# Altium schematic sheet Light Detector.SchDoc
size A4; SheetNumber: 2; SheetTotal: 7
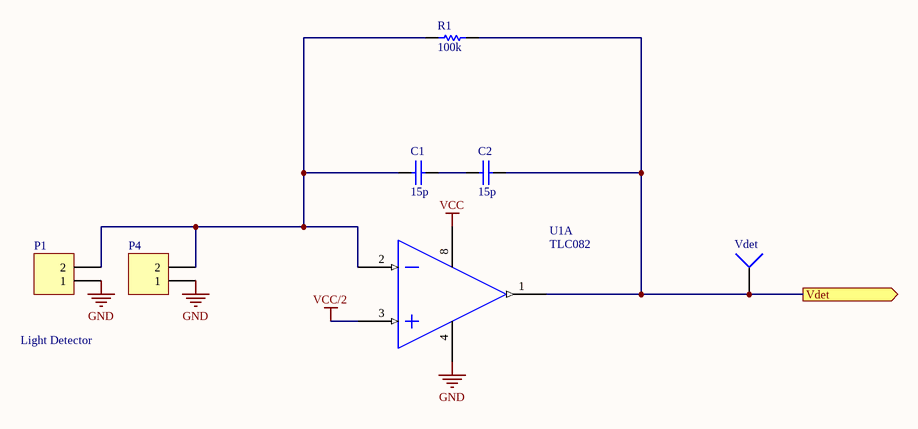
[diagram p0: Light Detector.SchDoc]

## Parts
C1  15p  [ece-RAD0.2]
C2  15p  [ece-RAD0.2]
P1  Header 2  [ece-HDR1X2]  (value not drawn)
P4  Header 2  [ece-HDR1X2]  (value not drawn)
R1  100k  [ece-AXIAL0.4]
U1  TLC082  [ECE-DIP8]  (part A of 2)
VOFF  Vdet  [ece-HDR1]

## Ports
Vdet (out)

## Nets
GND: P1.1 P4.1 U1.4(GND)
VCC: U1.8(V(+))
VCC/2: U1.3(IN1(+))
Vdet: C2.2 R1.2 U1.1(OUT1) VOFF.1 ; port Vdet
NetC1_1: C1.1 P1.2 P4.2 R1.1 U1.2(IN1(-))
NetC1_2: C1.2 C2.1

## Notes on the sheet
- Light Detector

## Library data of the parts
C1 C2 = CAP: Capacitor Non Polarised Through Hole; Value: 15p
P1 P4 = Header 2: Header, 2-Pin; LatestRevisionDate: 17-Jul-2002; LatestRevisionNote: Re-released for DXP Platform.; Publisher: Altium Limited
R1 = Res1: Resistor; Published: 8-Jun-2000; LatestRevisionDate: 17-Jul-2002; LatestRevisionNote: Re-released for DXP Platform.; PackageReference: AXIAL-0.3; Publisher: Altium Limited; Value: 100k
VOFF = Test pin: Socket; LatestRevisionDate: 17-Jul-2002; LatestRevisionNote: Re-released for DXP Platform.; Publisher: Altium Limited
U1 = TLC082: Value: TLC082